# EAGLE schematic voltage_divider (EAGLE 9.6.2)
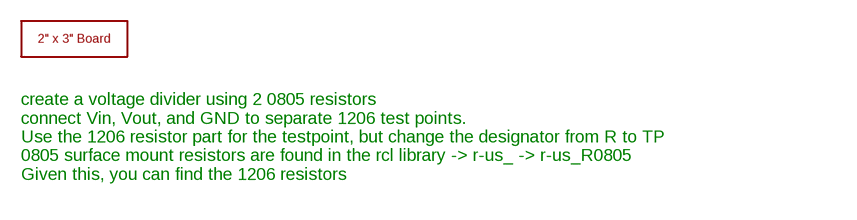
[diagram p0: schematic, sheet 1]

## Parts
U$1  2X3_BOARD_V2  [2X3_BOARD_V2]

## Notes on the sheet
- create a voltage divider using 2 0805 resistors
  connect Vin, Vout, and GND to separate 1206 test points. 
  Use the 1206 resistor part for the testpoint, but change the designator from R to TP
  0805 surface mount resistors are found in the rcl library -> r-us_ -> r-us_R0805
  Given this, you can find the 1206 resistors

## Library data of the parts
U$1 = voltera_community_lib:2X3_BOARD